# Altium schematic sheet RJ45.SchDoc
size A4; SheetNumber: 2; SheetTotal: 4
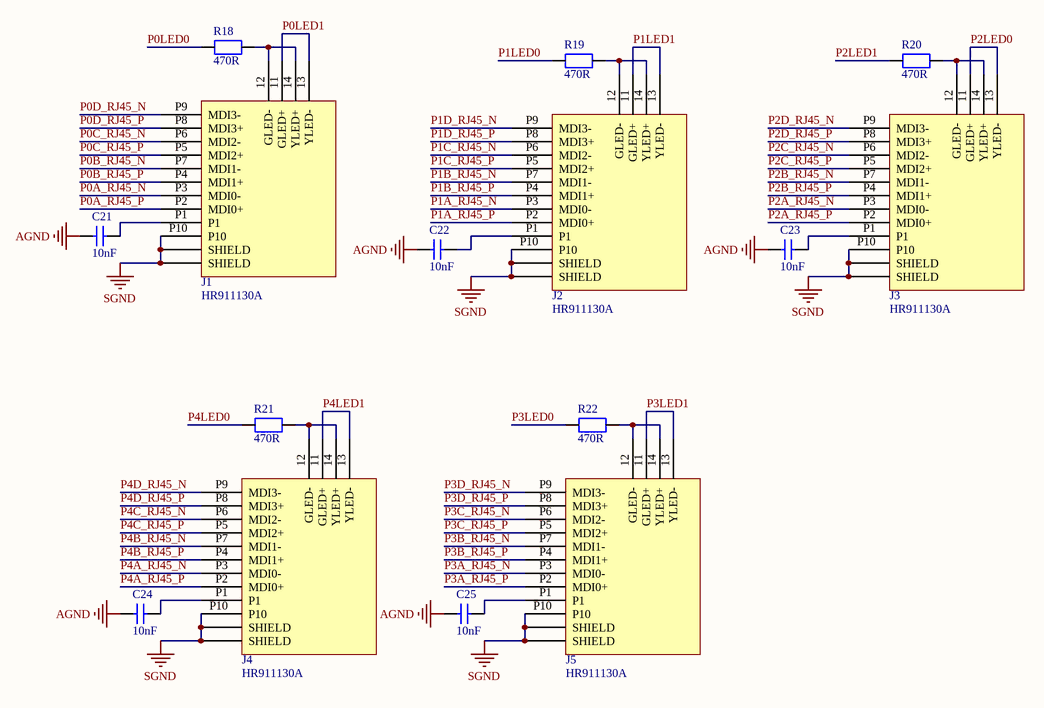
[diagram p0: RJ45.SchDoc]

## Parts
C21  10nF  [C-0603]
C22  10nF  [C-0603]
C23  10nF  [C-0603]
C24  10nF  [C-0603]
C25  10nF  [C-0603]
J1  HR911130A  [RJ45]
J2  HR911130A  [RJ45]
J3  HR911130A  [RJ45]
J4  HR911130A  [RJ45]
J5  HR911130A  [RJ45]
R18  470R  [RESMELF3515L]
R19  470R  [RESMELF3515L]
R20  470R  [RESMELF3515L]
R21  470R  [RESMELF3515L]
R22  470R  [RESMELF3515L]

## Nets
AGND: C21.2 C22.2 C23.2 C24.1 C25.2
SGND: J1.P10 J1.SHIELD0(SHIELD) J1.SHIELD1(SHIELD) J2.P10 J2.SHIELD0(SHIELD) J2.SHIELD1(SHIELD) J3.P10 J3.SHIELD0(SHIELD) J3.SHIELD1(SHIELD) J4.P10 J4.SHIELD0(SHIELD) J4.SHIELD1(SHIELD) J5.P10 J5.SHIELD0(SHIELD) J5.SHIELD1(SHIELD)
P0A_RJ45_N: J1.P3(MDI0-)
P0A_RJ45_P: J1.P2(MDI0+)
P0B_RJ45_N: J1.P7(MDI1-)
P0B_RJ45_P: J1.P4(MDI1+)
P0C_RJ45_N: J1.P6(MDI2-)
P0C_RJ45_P: J1.P5(MDI2+)
P0D_RJ45_N: J1.P9(MDI3-)
P0D_RJ45_P: J1.P8(MDI3+)
P0LED0: R18.1
P0LED1: J1.11(GLED+) J1.13(YLED-)
P1A_RJ45_N: J2.P3(MDI0-)
P1A_RJ45_P: J2.P2(MDI0+)
P1B_RJ45_N: J2.P7(MDI1-)
P1B_RJ45_P: J2.P4(MDI1+)
P1C_RJ45_N: J2.P6(MDI2-)
P1C_RJ45_P: J2.P5(MDI2+)
P1D_RJ45_N: J2.P9(MDI3-)
P1D_RJ45_P: J2.P8(MDI3+)
P1LED0: R19.1
P1LED1: J2.11(GLED+) J2.13(YLED-)
P2A_RJ45_N: J3.P3(MDI0-)
P2A_RJ45_P: J3.P2(MDI0+)
P2B_RJ45_N: J3.P7(MDI1-)
P2B_RJ45_P: J3.P4(MDI1+)
P2C_RJ45_N: J3.P6(MDI2-)
P2C_RJ45_P: J3.P5(MDI2+)
P2D_RJ45_N: J3.P9(MDI3-)
P2D_RJ45_P: J3.P8(MDI3+)
P2LED0: J3.11(GLED+) J3.13(YLED-)
P2LED1: R20.1
P3A_RJ45_N: J5.P3(MDI0-)
P3A_RJ45_P: J5.P2(MDI0+)
P3B_RJ45_N: J5.P7(MDI1-)
P3B_RJ45_P: J5.P4(MDI1+)
P3C_RJ45_N: J5.P6(MDI2-)
P3C_RJ45_P: J5.P5(MDI2+)
P3D_RJ45_N: J5.P9(MDI3-)
P3D_RJ45_P: J5.P8(MDI3+)
P3LED0: R22.1
P3LED1: J5.11(GLED+) J5.13(YLED-)
P4A_RJ45_N: J4.P3(MDI0-)
P4A_RJ45_P: J4.P2(MDI0+)
P4B_RJ45_N: J4.P7(MDI1-)
P4B_RJ45_P: J4.P4(MDI1+)
P4C_RJ45_N: J4.P6(MDI2-)
P4C_RJ45_P: J4.P5(MDI2+)
P4D_RJ45_N: J4.P9(MDI3-)
P4D_RJ45_P: J4.P8(MDI3+)
P4LED0: R21.1
P4LED1: J4.11(GLED+) J4.13(YLED-)
NetC21_1: C21.1 J1.P1
NetC22_1: C22.1 J2.P1
NetC23_1: C23.1 J3.P1
NetC24_2: C24.2 J4.P1
NetC25_1: C25.1 J5.P1
NetJ1_12: J1.12(GLED-) J1.14(YLED+) R18.2
NetJ2_12: J2.12(GLED-) J2.14(YLED+) R19.2
NetJ3_12: J3.12(GLED-) J3.14(YLED+) R20.2
NetJ4_12: J4.12(GLED-) J4.14(YLED+) R21.2
NetJ5_12: J5.12(GLED-) J5.14(YLED+) R22.2

## Library data of the parts
C21-C25 = C-0603
R18-R22 = CSR-0204